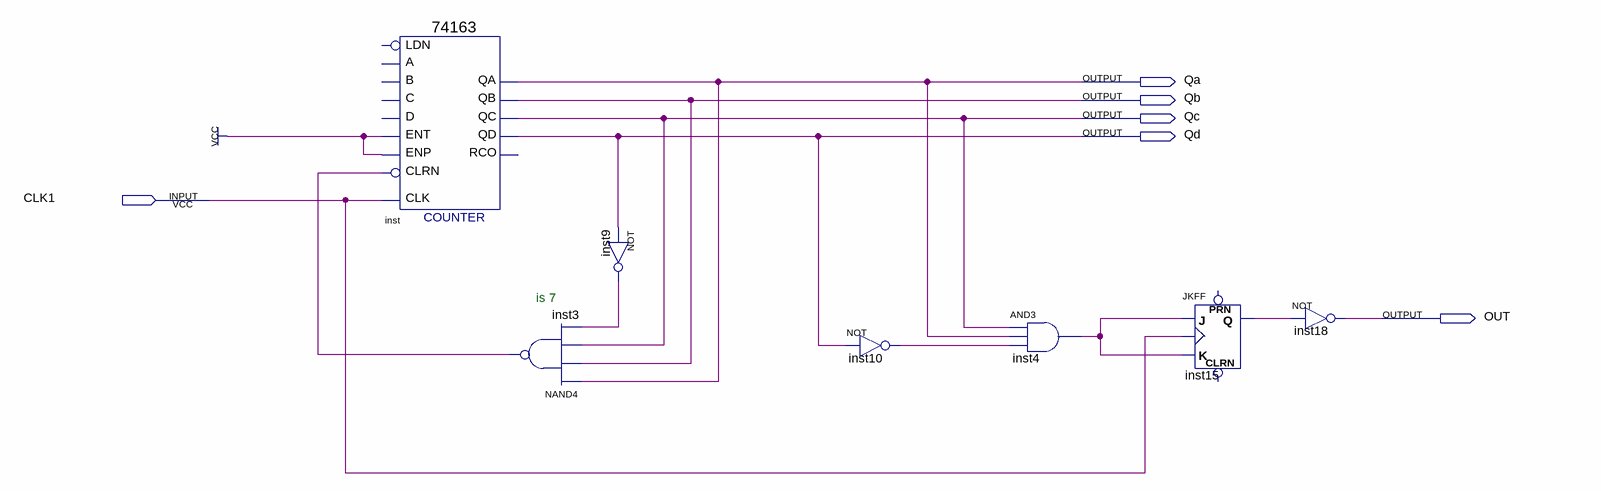
[diagram p0: schematic sheet]
// Quartus schematic task1Ref.bdf as structural Verilog: 7 symbols, 6 pins
module task1Ref (
  input  CLK1,
  output Qa,
  output Qb,
  output Qc,
  output Qd,
  output OUT
);

  wire inst3_out, inst4_out, inst9_out, inst10_out, inst15_q;

  \74163  inst (
    .ENT(1'b1), .CLRN(inst3_out), .CLK(CLK1), .ENP(1'b1), .QA(Qa), .QB(Qb), .QC(Qc), .QD(Qd));  // open: C, B, A, D, LDN, RCO
  nand inst3 (inst3_out, Qa, Qb, Qc, inst9_out);
  not inst9 (inst9_out, Qd);
  not inst10 (inst10_out, Qd);
  and inst4 (inst4_out, Qc, Qa, inst10_out);
  JKFF inst15 (.K(inst4_out), .J(inst4_out), .CLK(CLK1), .Q(inst15_q));  // open: PRN, CLRN
  not inst18 (OUT, inst15_q);

  // Notes on the sheet:
  //   is 7
endmodule
